# Altium schematic sheet Power.SchDoc
size A; SheetNumber: 6; SheetTotal: 6; SPICEModelCacheUQLPFCSE: <root> / <DocumentId>UQLPFCSE</DocumentId> / <CacheFrame Number="0"> / <Model Name="emk107bj104_aht" Kind="CKT"> / <Text>* EMK107BJ104_AHT     SPICE MODEL  ( General Type ) / *-------------------------------------------------------------------------------------------------------- / * Model Generated by TAIYO YUDEN Corporation (http://www.ty-top.com) / * Version 1.0 / * TAIYO YUDEN Control No. 170508_121019 / * Copyright(c) 2012 TAIYO YUDEN CO.,LTD. All Rights Reserved. / *-------------------------------------------------------------------------------------------------------- / * / * Products Name : Multilayer Ceramic Capacitors / * / * Characteristics : / *     Capacitance : 0.1 uF , Rated Voltage : 16V , TCC : X5R / *     Case Size : 1.6 x 0.8 / 0.063 x 0.031 [mm/inch] , Thickness : 0.8 / 0.031 [mm/inch] / *     (Conditions: Temperature = 25 degC , DC Bias Current/Voltage = 0A / 0V) / * / * Frequency Range : 40Hz - 3GHz / * / * External Node Assignments : / * / *  1  o---| |---o  2 / * / *-------------------------------------------------------------------------------------------------------- / .SubCkt EMK107BJ104_AHT 1 2 / **************************** / C0 1 110 0.090459u / Cm 1 101 4956.4p / C1 101 102 0.016591u / Rc1 101 102 43.844k / C2 102 103 7741.8p / Rc2 102 103 3.295k / C3 103 110 1316.9p / Rc3 103 110 73.25 / C2m 1 301 5652.5p / C21 301 302 0.070707u / Rc21 301 302 100.18k / C22 302 303 0.057154u / Rc22 302 303 103.86k / C23 303 304 0.037105u / Rc23 303 304 126.48k / C24 304 305 0.025687u / Rc24 304 305 5.6768k / C25 305 306 0.031692u / Rc25 305 306 4.3781k / C26 306 307 0.019496u / Rc26 306 307 431.82 / C27 307 308 9278.5p / Rc27 307 308 250.63 / C28 308 309 2021.1p / Rc28 308 309 351.66 / C29 309 110 132.48p / Rc29 309 110 53.803 / Rp0 1 110 5G / L0 110 120 0.28722n / Lm 120 130 0.14567n / L1 120 121 0.19688n / RL1 121 130 0.63688 / L2 120 122 0.4263n / RL2 122 130 1.7594 / L3 120 123 0.56496n / RL3 123 130 2.073 / CR 120 124 0.016445u / LR 124 125 0.19521n / RR 125 130 0.14106 / CL 130 140 1.6993p / LL 130 140 0.2325n / RL 130 140 47.364 / Rs 140 2 14.947m / **************************** / .ends EMK107BJ104_AHT</Text> / </Model> / <Model Name="tmk316bj105_d-t" Kind="CKT"> / <Text>* TMK316BJ105_D-T     SPICE MODEL  ( General Type ) / *-------------------------------------------------------------------------------------------------------- / * Model Generated by TAIYO YUDEN Corporation (http://www.ty-top.com) / * Version 1.0 / * TAIYO YUDEN Control No. 170508_100817 / * Copyright(c) 2012 TAIYO YUDEN CO.,LTD. All Rights Reserved. / *-------------------------------------------------------------------------------------------------------- / * / * Products Name : Multilayer Ceramic Capacitors / * / * Characteristics : / *     Capacitance : 1 uF , Rated Voltage : 25V , TCC : B / X5R / *     Case Size : 3.2 x 1.6 / 0.126 x 0.063 [mm/inch] , Thickness : 0.85 / 0.033 [mm/inch] / *     (Conditions: Temperature = 25 degC , DC Bias Current/Voltage = 0A / 0V) / * / * Frequency Range : 40Hz - 3GHz / * / * External Node Assignments : / * / *  1  o---| |---o  2 / * / *-------------------------------------------------------------------------------------------------------- / .SubCkt TMK316BJ105_D-T 1 2 / **************************** / C0 1 110 0.89653u / Cm 1 101 0.058713u / C1 101 102 0.1587u / Rc1 101 102 7.1768k / C2 102 103 0.049506u / Rc2 102 103 763.46 / C3 103 110 1507.5p / Rc3 103 110 12.633 / C2m 1 301 0.070806u / C21 301 302 0.3533u / Rc21 301 302 18.812k / C22 302 303 0.24304u / Rc22 302 303 25.852k / C23 303 304 0.44253u / Rc23 303 304 11.087k / C24 304 305 0.11927u / Rc24 304 305 1.9403k / C25 305 306 0.17455u / Rc25 305 306 1.1901k / C26 306 307 0.058236u / Rc26 306 307 156.55 / C27 307 308 4143.3p / Rc27 307 308 85.064 / C28 308 309 4159.9p / Rc28 308 309 75.965 / C29 309 110 294.26p / Rc29 309 110 34.212 / Rp0 1 110 500Meg / L0 110 120 0.44086n / Lm 120 130 0.34458n / RL1 120 130 141.25 / L2 120 122 0.91807n / RL2 122 130 0.61722 / L3 120 123 1.2468n / RL3 123 130 0.41744 / CR 120 124 9.0669u / LR 124 125 0.41723n / RR 125 130 0.25689 / CL 130 140 8.6808p / LL 130 140 0.28687n / RL 130 140 10.893 / Rs 140 2 11.509m / **************************** / .ends TMK316BJ105_D-T</Text> / </Model> / </CacheFrame> / </root>
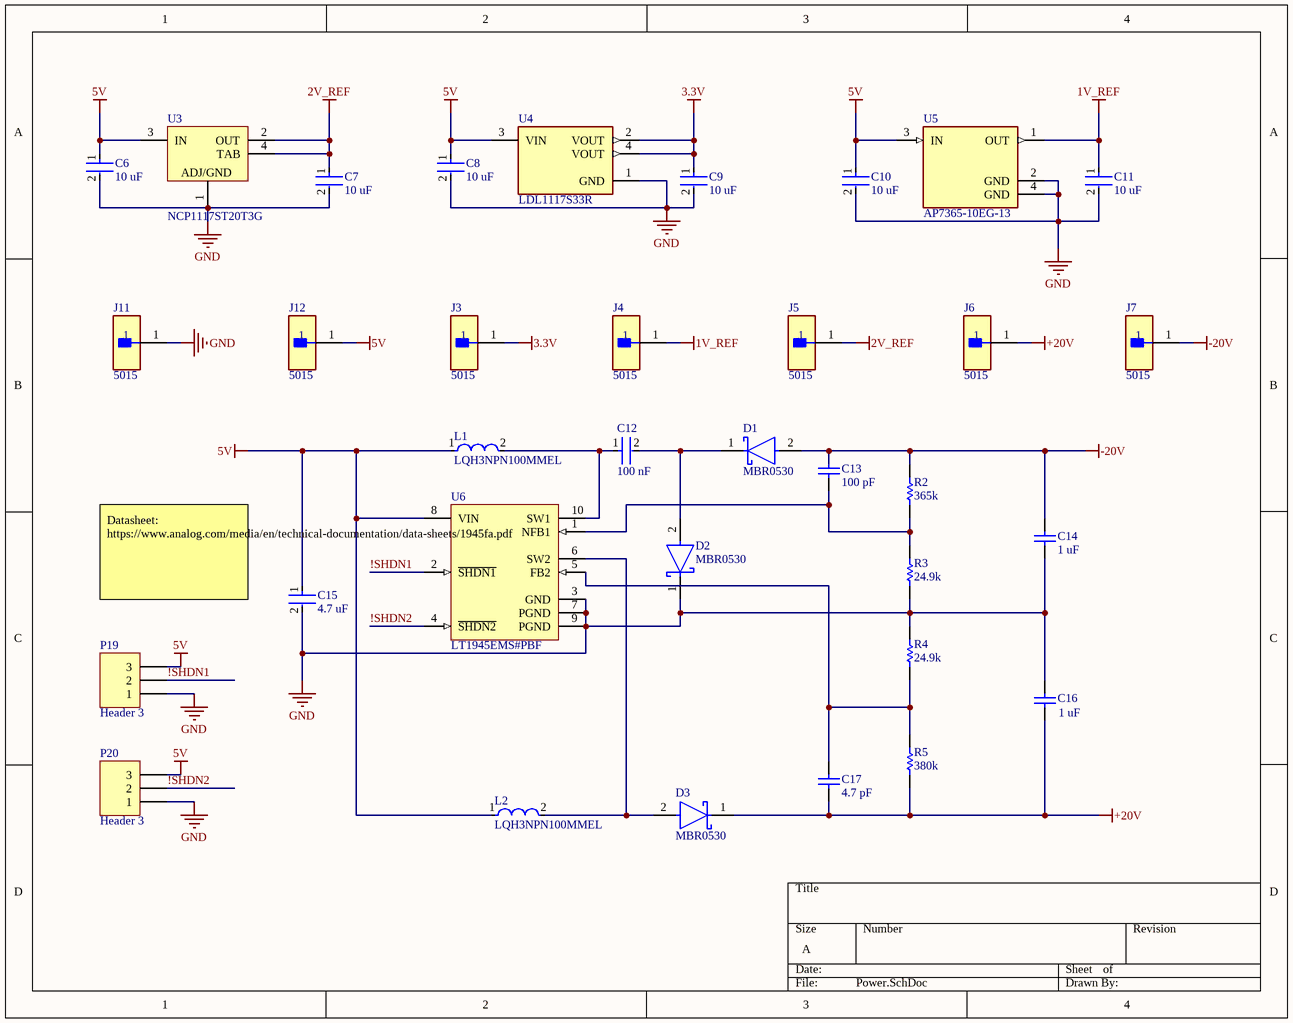
[diagram p0: Power.SchDoc]

## Parts
C6  10 uF  [FP-CL21-IPC_A]
C7  10 uF  [FP-CL21-IPC_A]
C8  10 uF  [FP-CL21-IPC_A]
C9  10 uF  [FP-CL21-IPC_A]
C10  10 uF  [FP-CL21-IPC_A]
C11  10 uF  [FP-CL21-IPC_A]
C12  100 nF  [FP-C0805C-DN-MFG]
C13  100 pF  [CAPC2013X140X50ML20T25]
C14  1 uF  [CAPC3216X110X50LL20T25]
C15  4.7 uF  [FP-C0805C475K3PACTU-MFG]
C16  1 uF  [CAPC3216X110X50LL20T25]
C17  4.7 pF  [CAPC2013X71X50ML20T25]
D1  MBR0530  [FP-425-04-MFG]
D2  MBR0530  [FP-425-04-MFG]
D3  MBR0530  [FP-425-04-MFG]
J3  5015  [FP-5015-MFG]
J4  5015  [FP-5015-MFG]
J5  5015  [FP-5015-MFG]
J6  5015  [FP-5015-MFG]
J7  5015  [FP-5015-MFG]
J11  5015  [FP-5015-MFG]
J12  5015  [FP-5015-MFG]
L1  LQH3NPN100MMEL  [FP-LQH3NPH_ME-MFG]
L2  LQH3NPN100MMEL  [FP-LQH3NPH_ME-MFG]
P19  Header 3  [HDR1X3]
P20  Header 3  [HDR1X3]
R2  365k  [RESC2013X70X40NL20T20]
R3  24.9k  [RESC2013X70X40LL20T20]
R4  24.9k  [RESC2013X70X40LL20T20]
R5  380k  [RESC2013X70X40ML20T20]
U3  NCP1117ST20T3G  [ONSC-SOT-223-4-318H-01_A_V]
U4  LDL1117S33R  [FP-SOT223-0046067-IPC_C]
U5  AP7365-10EG-13  [FP-SOT223-IPC_C]
U6  LT1945EMS#PBF  [LT-MS-10_N]

## Nets
1V_REF: C11.1 J4.1 U5.1(OUT)
2V_REF: C7.1 J5.1 U3.2(OUT) U3.4(TAB)
3.3V: C9.1 J3.1 U4.2(VOUT) U4.4(VOUT)
5V: C6.1 C8.1 C10.1 C15.1 J12.1 L1.1 L2.1 P19.3 P20.3 U3.3(IN) U4.3(VIN) U5.3(IN) U6.8(VIN)
+20V: C16.1 C17.1 D3.1(C) J6.1 R5.1
-20V: C13.1 C14.2 D1.2(A) J7.1 R2.2
GND: C6.2 C7.2 C8.2 C9.2 C10.2 C11.2 C14.1 C15.2 C16.2 D2.1(C) J11.1 P19.1 P20.1 R3.1 R4.2 U3.1(ADJ/GND) U4.1(GND) U5.2(GND) U5.4(GND) U6.3(GND) U6.7(PGND) U6.9(PGND)
!SHDN1: P19.2 U6.2(~{SHDN1})
!SHDN2: P20.2 U6.4(~{SHDN2})
NetC12_1: C12.1 L1.2 U6.10(SW1)
NetC12_2: C12.2 D1.1(C) D2.2(A)
NetC13_2: C13.2 R2.1 R3.2 U6.1(NFB1)
NetC17_2: C17.2 R4.1 R5.2 U6.5(FB2)
NetD3_2: D3.2(A) L2.2 U6.6(SW2)

## Notes on the sheet
- Datasheet: https://www.analog.com/media/en/technical-documentation/data-sheets/1945fa.pdf

## Library data of the parts
C6-C11 = CMP-13271-002975-1: CL21 Series 0805 10uF 25V ±10% Tolerance X5R Multilayer Ceramic Chip Capacitor; Case Code (Imperial): 0805; Length: 2mm; Case/Package: 0805; Packaging: Tape and Reel; Width: 0.049inch; Tolerance: 10%; Mount: Surface Mount; Min Operating Temperature: -55°C; Thickness: 0.057inch; Height: 1.25mm; Dielectric: X5R; Package Quantity: 1; Depth: 1.25mm; Capacitance: 10uF; Voltage Rating: 25V; Case Code (Metric): 2012; Max Operating Temperature: 85°C; Radiation Hardening: No
C12 = CMP-2007-00279-2: CAP CER 0.1UF 50V X7R 0805; Manufacturer Part Number: C0805C104K5RACTU; Manufacturer: KEMET; Value: 0.10 μF; Tolerance: 0.1; Temperature Coefficient: 30ppm/°C; Material: Ceramic; Device Class L2: Capacitors; Temperature Range Low: -55°C; Voltage Rating: 50 V; Digikey Description: CAP CER 0.1UF 50V X7R 0805; Category: Cap; ComponentLink2Description: Datasheet; Octopart: https://octopart.com/c0805c104k5ractu-kemet-143926; RoHS: TRUE; ComponentLink2URL: https://content.kemet.com/datasheets/KEM_C1003_C0G_SMD.pdf; Temperature Characteristic: X7R; Temperature: -55°C to +125°C; Height: 0.88mm; Temperature Range High: +125°C; Device Class L1: Passive Components; Automotive: No; Lead Free: Yes; Ipc Land Pattern Name: CAPC200125X78; Device Class L3: Ceramic Capacitors; Mouser Description: Cap Ceramic 0.1uF 50V X7R 10% SMD 2.0 x 1.2 mm 125 C Paper T/R; Capacitance: 0.10 μF; Package: C0805C-DN
C13 = CMP-2007-04713-1: 08055C101KAT2A; Manufacturer: AVX Interconnect / Elco; Part Number: 08055C101KAT2A
C14 C16 = CMP-2000-06011-1: C1206C105K5RACTU; Manufacturer: Kemet; Case Height: 1mm; Dielectric: X7R; Voltage Rating: 50V; Capacitance: 1uF; Temperature Coefficient / Code: +/-15%; Case Length: 3.2mm; Case Width: 1.6mm; Type: SMDMLCCX7R6.3-250VDCCommericalGrade; Tolerance: 10%; Class: Class1; Capacitance - nF: 1000nF; Datasheet URL: http://www.kemet.com/docfinder?Partnumber=C1206C105K5RACTU; Product Category: MultilayerCeramicCapacitorsMLCC-SMD/SMT; Termination Style: SMD/SMT; Dimensions: 1.6mmWx3.2mmLx1mmH; Voltage Rating DC: 50V; Datasheet Version: 02/2016; Packaging: Reel; Brand: Kemet; RoHS: Details; Minimum Operating Temperature: -55C; Operating Temperature Range: -55Cto+125C; Package Reference: 1206; Manufacturer URL: http://www.kemet.com/; Product: GeneralTypeMLCCs; Package Description: 2-Pin Surface Mount Device, Body 3.2 x 1.6 mm; Mounting Technology: SurfaceMount; Case Code - mm: 3216; Maximum Operating Temperature: +125C; Series: C1206C; Factory Pack Quantity: 2500; Package / Case: 1206(3216metric); Case Code - in: 1206
C15 = CMP-2007-01010-2: CAP CER 4.7UF 25V X5R 0805; Tolerance: 10%; Dielectric Material: Ceramic; Dissipation Factor: 5%; Length: 2mm; Number of Pins: 2; Voltage Rating (DC): 25V; Depth: 1.25mm; Min Operating Temperature: -55°C; Capacitance: 4.7uF; Series: C0805C; Lead Free: Lead Free; Dielectric: X5R; REACH SVHC: No SVHC; Termination: SMD/SMT; Mount: PCB; Package Quantity: 2500; Contact Plating: Tin; Case Code (Imperial): 0805; Max Operating Temperature: 85°C; Width: 1.2mm; Voltage: 25V; Case/Package: 0805; Packaging: Tape and Reel; Height: 1.25mm; RoHS Compliant: Yes; Construction: Flat; Case Code (Metric): 2012; Radiation Hardening: No
C17 = CMP-1036-00549-2: 08055A4R7CAT2A; Manufacturer: AVX Interconnect / Elco; Part Number: 08055A4R7CAT2A
D1-D3 = CMP-2000-05113-2: DIODE SCHOTTKY 30V 500MA SOD123; Polarity: Standard; Max Reverse Leakage Current: 130uA; Forward Voltage: 430mV; Element Configuration: Single; Peak Non-Repetitive Surge Current: 5.5A; REACH SVHC: No SVHC; Contact Plating: Tin; Width: 1.6mm; Weight: 0.03g; Max Reverse Voltage (DC): 30V; Mount: Surface Mount; Max Repetitive Reverse Voltage (Vrrm): 30V; Number of Pins: 2; Height: 1.03mm; Current Rating: 500mA; Max Forward Surge Current (Ifsm): 5.5A; Lead Free: Lead Free; Max Surge Current: 5.5A; Peak Reverse Current: 130uA; Min Operating Temperature: -65°C; Radiation Hardening: No; Max Operating Temperature: 150°C; Average Rectified Current: 500mA; Packaging: Tape and Reel; Length: 2.7mm; Forward Current: 500mA; Voltage Rating (DC): 30V; Package Quantity: 1; Output Current: 500mA
J3-J7 J11 J12 = CMP-2000-05183-2: PC TEST POINT MINIATURE; Manufacturer: keystone; Number Of Contacts: 1; Conn Orientation: Straight; Category: Conn; Manufacturer Part Number: 5015; Digikey Description: PC TEST POINT MINIATURE; Automotive: No; Lead Free: Yes; Octopart: https://octopart.com/5015-keystone-3822; ComponentLink2URL: http://www.keyelco.com/product-pdf.cfm?p=1353; Package: 5015; RoHS: TRUE; Device Class L3: unset; Device Class L2: unset; Contact Material: Silver; Device Class L1: Connectors; Height: 1.65mm; ComponentLink2Description: Datasheet
L1 L2 = CMP-06042-002074-1: Wire Wound Ferrite Inductor for Power Lines 10μH ±20% 0.228Ω 1280mA 1212; Current Rating: 1.28A; DC Resistance (DCR): 228mR; Inductance: 10uH; Saturation Current: 810mA; Self Resonant Frequency: 20MHz; Shielding: Shielded; Test Frequency: 1MHz; Core Material: Ferrite; Resistor Type: Wirewound; Case/Package: 1212; Min Operating Temperature: -40°C; Packaging: Tape and Reel; Max Operating Temperature: 85°C; Tolerance: 20%; Case Code (Imperial): 1212; Case Code (Metric): 3030; Mount: Surface Mount
P19 P20 = Header 3: Header, 3-Pin; LatestRevisionDate: 17-Jul-2002; LatestRevisionNote: Re-released for DXP Platform.; Publisher: Altium Limited
R2 = CMP-2001-00152-1: Part Number: ERJ-6ENF3653V; Manufacturer: Panasonic
R3 R4 = CMP-2001-00073-1: Part Number: ERJ-6ENF2492V; Manufacturer: Panasonic
R5 = CMP-2001-00160-1: Part Number: ERJ-6ENF3833V; Manufacturer: Panasonic
U3 = CMP-1679-00010-1: Low-Dropout Positive Fixed Voltage Regulator, 1 A, 2.0 V Output Voltage, 0 to 125 degC, 4-Pin SOT-223 (318H-01), Pb-Free, Tape and Reel; Resistance: 220 kohm; Type (Resistor): Thick Film; Voltage Rating: 75 V; Tolerance: 1%; Case\Package: 0603; Power Rating: 100 mW; Width: 0.85 mm; Weight: 7.1E-05 oz; ComponentLink2URL: http://www.onsemi.com/pub_link/Collateral/NCP1117-D.PDF; RoHSCompliant: true; Height: 0.45 mm; PackageDescription: 4-Pin Small Outline Transistor, Body 6.5 x 3.5 mm, Pitch 2.3 mm; ComponentLink1Description: Manufacturer URL; ComponentLink1URL: http://www.onsemi.com/; PackageReference: SOT-223-4-318H-01_A; Max Operating Temperature: 155 degC; Packaging: Tape and Reel; REACH SVHC: Unknown; Length: 1.55 mm; Package Quantity: 5000; Radiation Hardening: No; Min Operating Temperature: -55 degC; DatasheetVersion: Rev. 27, 09/2014; Mount: Surface Mount; Case Code (Imperial): 0603; Case Code (Metric): 1608; ComponentLink2Description: Datasheet
U4 = CMP-12153-000006-1: IC REG LINEAR 3.3V 1.2A SOT223; Manufacturer: STMicroelectronics; Output Type: Fixed; Min Supply Voltage: 2.6V; Number Of Outputs: 1; Dropout Voltage: 350mV; Output Current: 2A; Nominal Supply Current: 250uA; Standoff Height: 0.02mm; Max Supply Voltage: 18V; Max Junction Temp: +125°C; Accuracy Percentage: 2%; Automotive: No; Device Class L2: Power Management ICs; Height: 1.9mm; Octopart: https://octopart.com/ldl1117s33r-stmicroelectronics-81876163; Output Voltage: 3.3V; Package: SOT223-0046067; Lead Free: Yes; Temperature Range Low: -40°C; Category: IC; Device Class L1: Integrated Circuits (ICs); Ipc Land Pattern Name: SOT230P700X190-4; Mouser Description: LDL1117 Series 1.2 A 3.3 V High PSRR LDO Linear Voltage Regulator-SOT-223; ComponentLink2Description: Datasheet; ComponentLink2URL: https://www.st.com/resource/en/datasheet/ldl1117.pdf; Device Class L3: Voltage Regulators - Linear; Manufacturer Part Number: LDL1117S33R; Temperature Range High: +125°C; Digikey Description: IC REG LINEAR 3.3V 1.2A SOT223; Temperature: -40°C to +125°C; RoHS: TRUE
U5 = CMP-12756-000040-1: IC REG LIN 1V 600MA SOT223-3; Output Voltage: 3.3V; Max Input Voltage: 6V; Min Current Limit: 800mA; Polarity: Positive; Accuracy: 2%; Number of Outputs: 1; Quiescent Current: 80uA; Output Type: Fixed; Dropout Voltage: 300mV; Min Input Voltage: 2V; Package Quantity: 2500; Number of Pins: 4; Packaging: Tape and Reel; Min Operating Temperature: -40°C; Mount: Surface Mount; Output Current: 600mA; Max Output Current: 600mA; Max Operating Temperature: 85°C; Case/Package: SOT-223-3; Radiation Hardening: No; REACH SVHC: No SVHC; Number of Regulators: 1; Weight: 0.000282oz
U6 = CMP-0478-00153-1: Dual Micropower DC/DC Converter with Positive and Negative Outputs, 1.2 to 15 V Vin, 10-pin SOP (MS-10), -40 to 85 degC, Pb-Free; Manufacturer: Linear Technology; Number of Outputs: 2; Vin Max(V): 15; Vin Min(V): 1.2; ComponentLink3Description: Package Specification; RoHS: TRUE; ComponentLink1Description: Manufacturer URL; ComponentLink2URL: http://cds.linear.com/docs/en/datasheet/1945fa.pdf; PartNumber: LT1945EMS#PBF; Mounting Technology: Surface Mount; PackageVersion: Rev. E, 06/2010; ComponentLink1URL: http://www.linear.com/; DatasheetVersion: Rev. A; PackageReference: MS-10; ComponentLink2Description: Datasheet; PackageDescription: 10-Pin Plastic MSOP, Body 3 x 3 mm, Pitch 0.5 mm; ComponentLink3URL: http://cds.linear.com/docs/en/packaging/05081661_F_MS.pdf